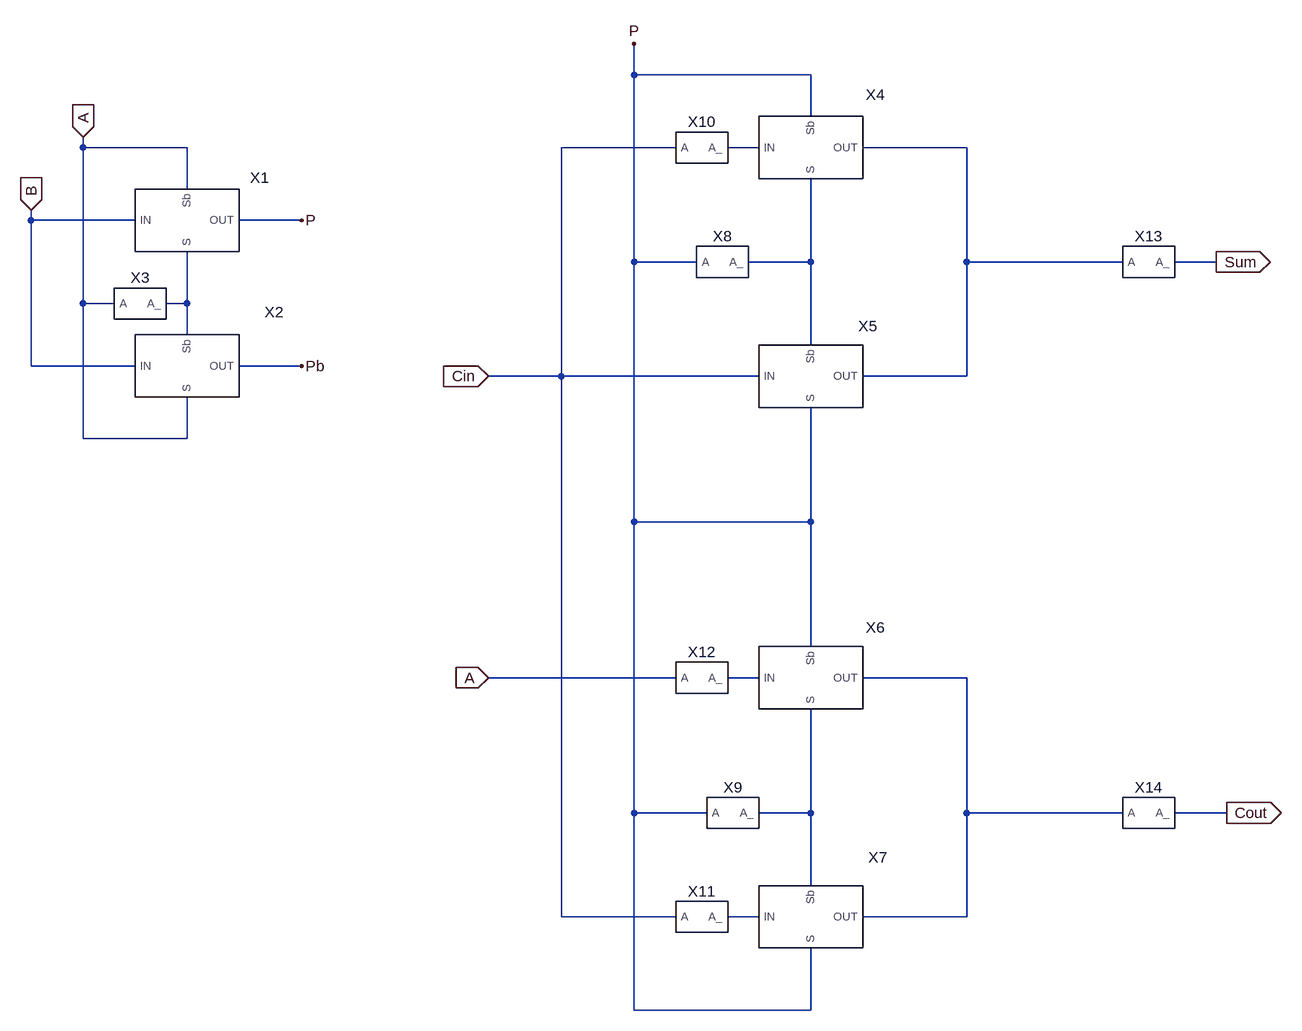
[diagram p0: schematic Draft1.asc]
Draft1.asc, the LTspice schematic file:
Version 4
SHEET 1 1424 948
WIRE 400 -496 400 -544
WIRE 672 -496 400 -496
WIRE 672 -432 672 -496
WIRE -448 -384 -448 -400
WIRE -288 -384 -448 -384
WIRE 464 -384 288 -384
WIRE 592 -384 544 -384
WIRE 912 -384 752 -384
WIRE -288 -320 -288 -384
WIRE -528 -272 -528 -288
WIRE -368 -272 -528 -272
WIRE -112 -272 -208 -272
WIRE 400 -208 400 -496
WIRE 496 -208 400 -208
WIRE 672 -208 672 -336
WIRE 672 -208 576 -208
WIRE 912 -208 912 -384
WIRE 1152 -208 912 -208
WIRE 1296 -208 1232 -208
WIRE -448 -144 -448 -384
WIRE -400 -144 -448 -144
WIRE -288 -144 -288 -224
WIRE -288 -144 -320 -144
WIRE -288 -96 -288 -144
WIRE 672 -80 672 -208
WIRE -528 -48 -528 -272
WIRE -368 -48 -528 -48
WIRE -112 -48 -208 -48
WIRE 288 -32 288 -384
WIRE 288 -32 176 -32
WIRE 592 -32 288 -32
WIRE 912 -32 912 -208
WIRE 912 -32 752 -32
WIRE -448 64 -448 -144
WIRE -288 64 -288 0
WIRE -288 64 -448 64
WIRE 400 192 400 -208
WIRE 672 192 672 16
WIRE 672 192 400 192
WIRE 672 384 672 192
WIRE 464 432 176 432
WIRE 592 432 544 432
WIRE 912 432 752 432
WIRE 400 640 400 192
WIRE 512 640 400 640
WIRE 672 640 672 480
WIRE 672 640 592 640
WIRE 912 640 912 432
WIRE 1152 640 912 640
WIRE 1312 640 1232 640
WIRE 672 752 672 640
WIRE 288 800 288 -32
WIRE 464 800 288 800
WIRE 592 800 544 800
WIRE 912 800 912 640
WIRE 912 800 752 800
WIRE 400 944 400 640
WIRE 672 944 672 848
WIRE 672 944 400 944
FLAG -448 -400 A
IOPIN -448 -400 In
FLAG -528 -288 B
IOPIN -528 -288 In
FLAG -112 -272 P
FLAG -112 -48 Pb
FLAG 176 432 A
IOPIN 176 432 In
FLAG 176 -32 Cin
IOPIN 176 -32 In
FLAG 400 -544 P
FLAG 1296 -208 Sum
IOPIN 1296 -208 Out
FLAG 1312 640 Cout
IOPIN 1312 640 Out
SYMBOL TG -288 -272 R0
WINDOW 0 112 -50 Bottom 2
SYMATTR InstName X1
SYMBOL TG -288 -48 R0
WINDOW 0 134 -67 Bottom 2
SYMATTR InstName X2
SYMBOL INVERT -368 -144 R0
SYMATTR InstName X3
SYMBOL TG 672 -384 R0
WINDOW 0 99 -66 Bottom 2
SYMATTR InstName X4
SYMBOL TG 672 -32 R0
WINDOW 0 88 -62 Bottom 2
SYMATTR InstName X5
SYMBOL TG 672 432 R0
WINDOW 0 99 -62 Bottom 2
SYMATTR InstName X6
SYMBOL TG 672 800 R0
WINDOW 0 103 -76 Bottom 2
SYMATTR InstName X7
SYMBOL INVERT 528 -208 R0
SYMATTR InstName X8
SYMBOL INVERT 544 640 R0
SYMATTR InstName X9
SYMBOL INVERT 496 -384 R0
SYMATTR InstName X10
SYMBOL INVERT 496 800 R0
SYMATTR InstName X11
SYMBOL INVERT 496 432 R0
SYMATTR InstName X12
SYMBOL INVERT 1184 -208 R0
SYMATTR InstName X13
SYMBOL INVERT 1184 640 R0
SYMATTR InstName X14

The netlist it stands for:
* Draft1.asc
XX1 N004 A B P TG  ; pins S Sb IN OUT
XX2 A N004 B Pb TG  ; pins S Sb IN OUT
XX3 A N004 INVERT  ; pins A A_
XX4 N003 P N001 N002 TG  ; pins S Sb IN OUT
XX5 P N003 Cin N002 TG  ; pins S Sb IN OUT
XX6 N007 P N005 N006 TG  ; pins S Sb IN OUT
XX7 P N007 N008 N006 TG  ; pins S Sb IN OUT
XX8 P N003 INVERT  ; pins A A_
XX9 P N007 INVERT  ; pins A A_
XX10 Cin N001 INVERT  ; pins A A_
XX11 Cin N008 INVERT  ; pins A A_
XX12 A N005 INVERT  ; pins A A_
XX13 N002 Sum INVERT  ; pins A A_
XX14 N006 Cout INVERT  ; pins A A_
.backanno
.end